# Altium schematic sheet PHOTODIODE.SchDoc
size 420 x 297 mm; SheetNumber: 3; SheetTotal: 7
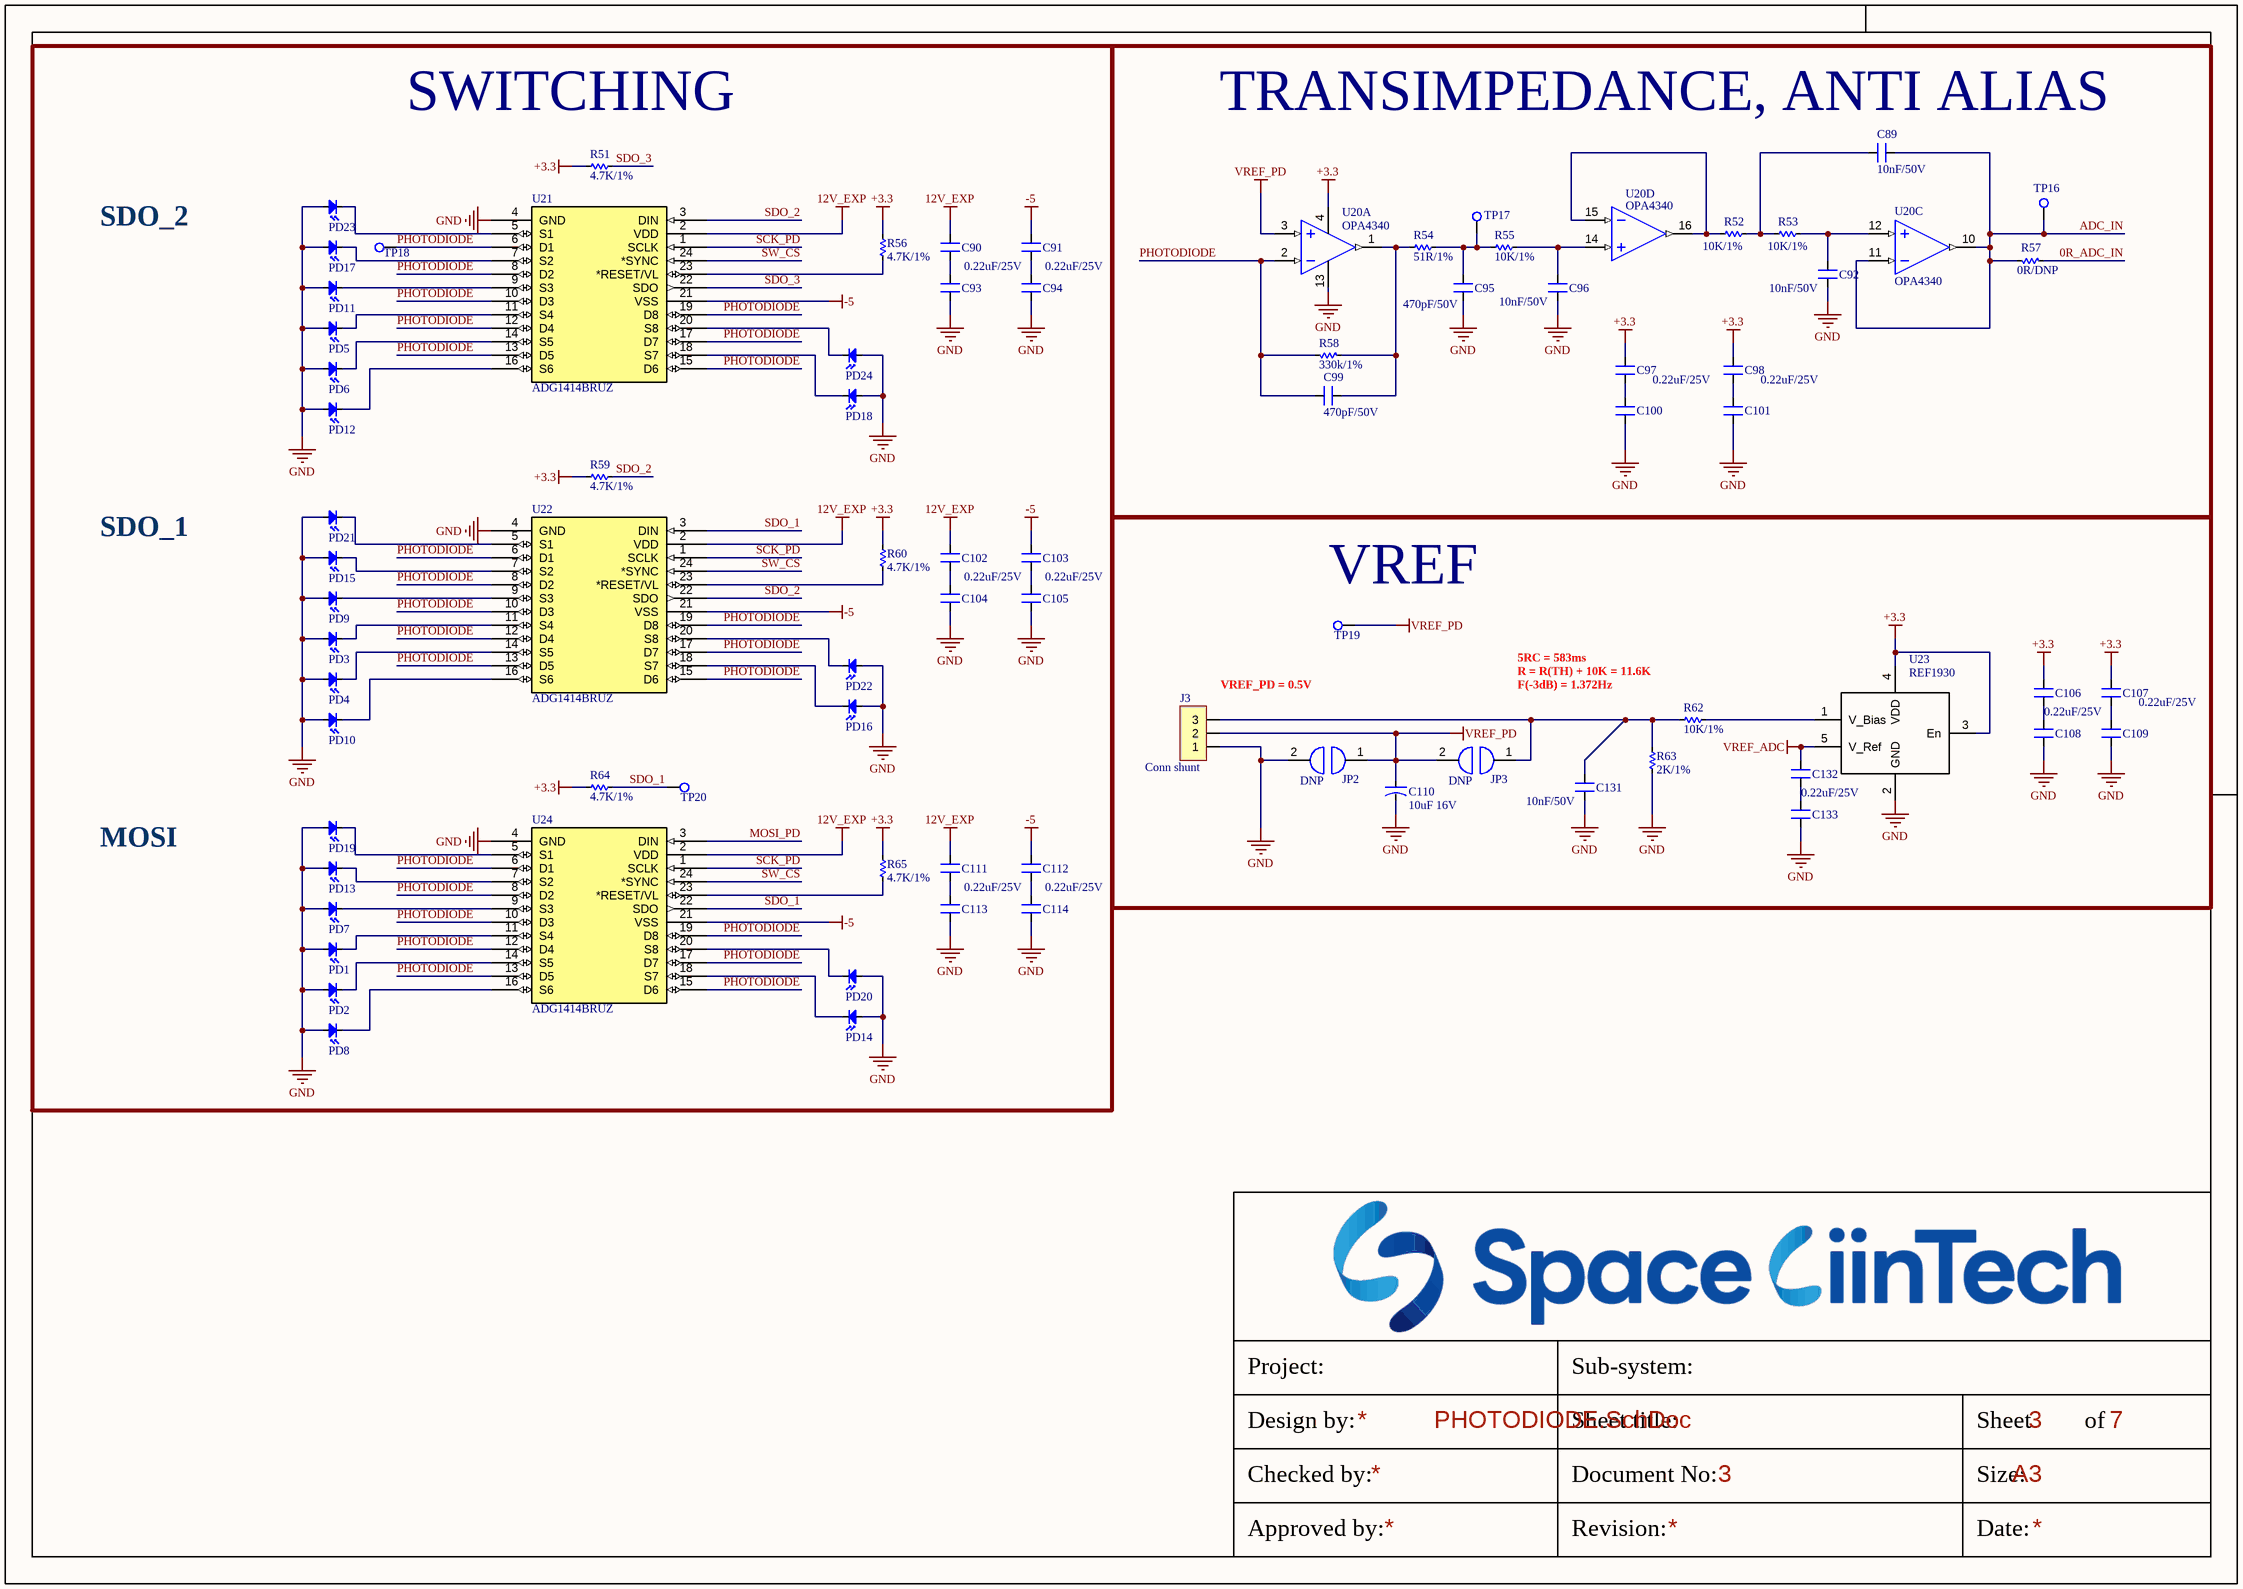
[diagram p0: PHOTODIODE.SchDoc]

## Parts
C89  10nF/50V  [CN-SMD-0603]
C90  0.22uF/25V  [CN-SMD-0603]
C91  0.22uF/25V  [CN-SMD-0603]
C92  10nF/50V  [CN-SMD-0603]
C93  0.22uF/25V  [CN-SMD-0603]  (value not drawn)
C94  0.22uF/25V  [CN-SMD-0603]  (value not drawn)
C95  470pF/50V  [CN-SMD-0603]
C96  10nF/50V  [CN-SMD-0603]
C97  0.22uF/25V  [CN-SMD-0603]
C98  0.22uF/25V  [CN-SMD-0603]
C99  470pF/50V  [CN-SMD-0603]
C100  0.22uF/25V  [CN-SMD-0603]  (value not drawn)
C101  0.22uF/25V  [CN-SMD-0603]  (value not drawn)
C102  0.22uF/25V  [CN-SMD-0603]
C103  0.22uF/25V  [CN-SMD-0603]
C104  0.22uF/25V  [CN-SMD-0603]  (value not drawn)
C105  0.22uF/25V  [CN-SMD-0603]  (value not drawn)
C106  0.22uF/25V  [CN-SMD-0603]
C107  0.22uF/25V  [CN-SMD-0603]
C108  0.22uF/25V  [CN-SMD-0603]  (value not drawn)
C109  0.22uF/25V  [CN-SMD-0603]  (value not drawn)
C110  10uF 16V  [CAP_TANT_1206]
C111  0.22uF/25V  [CN-SMD-0603]
C112  0.22uF/25V  [CN-SMD-0603]
C113  0.22uF/25V  [CN-SMD-0603]  (value not drawn)
C114  0.22uF/25V  [CN-SMD-0603]  (value not drawn)
C131  10nF/50V  [CN-SMD-0603]
C132  0.22uF/25V  [CN-SMD-0603]
C133  0.22uF/25V  [CN-SMD-0603]  (value not drawn)
J3  Conn shunt  [M50-3930342]
JP2  DNP  [JUMPER_1608]
JP3  DNP  [JUMPER_1608]
PD1  Photodiode  [VEMD5080X01]  (value not drawn)
PD2  Photodiode  [VEMD5080X01]  (value not drawn)
PD3  Photodiode  [VEMD5080X01]  (value not drawn)
PD4  Photodiode  [VEMD5080X01]  (value not drawn)
PD5  Photodiode  [VEMD5080X01]  (value not drawn)
PD6  Photodiode  [VEMD5080X01]  (value not drawn)
PD7  Photodiode  [VEMD5080X01]  (value not drawn)
PD8  Photodiode  [VEMD5080X01]  (value not drawn)
PD9  Photodiode  [VEMD5080X01]  (value not drawn)
PD10  Photodiode  [VEMD5080X01]  (value not drawn)
PD11  Photodiode  [VEMD5080X01]  (value not drawn)
PD12  Photodiode  [VEMD5080X01]  (value not drawn)
PD13  Photodiode  [VEMD5080X01]  (value not drawn)
PD14  Photodiode  [VEMD5080X01]  (value not drawn)
PD15  Photodiode  [VEMD5080X01]  (value not drawn)
PD16  Photodiode  [VEMD5080X01]  (value not drawn)
PD17  Photodiode  [VEMD5080X01]  (value not drawn)
PD18  Photodiode  [VEMD5080X01]  (value not drawn)
PD19  Photodiode  [VEMD5080X01]  (value not drawn)
PD20  Photodiode  [VEMD5080X01]  (value not drawn)
PD21  Photodiode  [VEMD5080X01]  (value not drawn)
PD22  Photodiode  [VEMD5080X01]  (value not drawn)
PD23  Photodiode  [VEMD5080X01]  (value not drawn)
PD24  Photodiode  [VEMD5080X01]  (value not drawn)
R51  4.7K/1%  [RES-SMD-0603]
R52  10K/1%  [RES-SMD-0603]
R53  10K/1%  [RES-SMD-0603]
R54  51R/1%  [RES-SMD-0603]
R55  10K/1%  [RES-SMD-0603]
R56  4.7K/1%  [RES-SMD-0603]
R57  0R/DNP  [RES-SMD-0603]
R58  330k/1%  [RES-SMD-0603]
R59  4.7K/1%  [RES-SMD-0603]
R60  4.7K/1%  [RES-SMD-0603]
R62  10K/1%  [RES-SMD-0603]
R63  2K/1%  [RES-SMD-0603]
R64  4.7K/1%  [RES-SMD-0603]
R65  4.7K/1%  [RES-SMD-0603]
TP16  Test_Point  [TESTPOINT]  (value not drawn)
TP17  Test_Point  [TESTPOINT]  (value not drawn)
TP18  Test_Point  [TESTPOINT]  (value not drawn)
TP19  Test_Point  [TESTPOINT]  (value not drawn)
TP20  Test_Point  [TESTPOINT]  (value not drawn)
U20  OPA4340  [SSOP16]  (parts A,C,D of 4)
U21  ADG1414BRUZ  [TSSOP24]
U22  ADG1414BRUZ  [TSSOP24]
U23  REF1930  [SOT23-5]
U24  ADG1414BRUZ  [TSSOP24]

## Blocks framed on the sheet
SWITCHING: C90 C91 C93 C94 C102-C105 C111-C114 PD1-PD24 R51 R56 R59 R60 R64 R65 TP18 TP20 U21 U22 U24
TRANSIMPEDANCE, ANTI ALIAS: C89 C92 C95-C101 R52-R55 R57 R58 TP16 TP17 U20
VREF: C106-C110 C131-C133 J3 JP2 JP3 R62 R63 TP19 U23

## Nets
12V_EXP: C90.2 C102.2 C111.2 U21.2(VDD) U22.2(VDD) U24.2(VDD)
+3.3: C97.2 C98.2 C106.2 C107.2 R51.2 R56.2 R59.2 R60.2 R64.2 R65.2 U20.4(+V) U23.3(En) U23.4(VDD)
-5: C91.2 C103.2 C112.2 U21.21(VSS) U22.21(VSS) U24.21(VSS)
GND: C92.1 C93.1 C94.1 C95.1 C96.1 C100.1 C101.1 C104.1 C105.1 C108.1 C109.1 C110.2 C113.1 C114.1 C131.1 C133.1 J3.1 JP2.2 PD1.1(A) PD2.1(A) PD3.1(A) PD4.1(A) PD5.1(A) PD6.1(A) PD7.1(A) PD8.1(A) PD9.1(A) PD10.1(A) PD11.1(A) PD12.1(A) PD13.1(A) PD14.1(A) PD15.1(A) PD16.1(A) PD17.1(A) PD18.1(A) PD19.1(A) PD20.1(A) PD21.1(A) PD22.1(A) PD23.1(A) PD24.1(A) R63.1 U20.13(-V) U21.4(GND) U22.4(GND) U23.2(GND) U24.4(GND)
VREF_ADC: C132.2 U23.5(V_Ref)
VREF_PD: C110.1 J3.2 JP2.1 JP3.2 TP19.1 U20.3(IN+)
0R_ADC_IN: R57.1
ADC_IN: C89.1 R57.2 TP16.1 U20.10(OUT) U20.11(IN-)
MOSI_PD: U24.3(DIN)
PHOTODIODE: C99.1 R58.1 TP18.1 U20.2(IN-) U21.6(D1) U21.8(D2) U21.10(D3) U21.12(D4) U21.13(D5) U21.15(D6) U21.17(D7) U21.19(D8) U22.6(D1) U22.8(D2) U22.10(D3) U22.12(D4) U22.13(D5) U22.15(D6) U22.17(D7) U22.19(D8) U24.6(D1) U24.8(D2) U24.10(D3) U24.12(D4) U24.13(D5) U24.15(D6) U24.17(D7) U24.19(D8)
SCK_PD: U21.1(SCLK) U22.1(SCLK) U24.1(SCLK)
SDO_1: R64.1 TP20.1 U22.3(DIN) U24.22(SDO)
SDO_2: R59.1 U21.3(DIN) U22.22(SDO)
SDO_3: R51.1 U21.22(SDO)
SW_CS: U21.24(*SYNC) U22.24(*SYNC) U24.24(*SYNC)
NetC89_2: C89.2 R52.2 R53.1
NetC90_1: C90.1 C93.2
NetC91_1: C91.1 C94.2
NetC92_2: C92.2 R53.2 U20.12(IN+)
NetC95_2: C95.2 R54.2 R55.1 TP17.1
NetC96_2: C96.2 R55.2 U20.14(IN+)
NetC97_1: C97.1 C100.2
NetC98_1: C98.1 C101.2
NetC99_2: C99.2 R54.1 R58.2 U20.1(OUT)
NetC102_1: C102.1 C104.2
NetC103_1: C103.1 C105.2
NetC106_1: C106.1 C108.2
NetC107_1: C107.1 C109.2
NetC111_1: C111.1 C113.2
NetC112_1: C112.1 C114.2
NetC131_2: C131.2 J3.3 JP3.1 R62.2 R63.2
NetC132_1: C132.1 C133.2
NetPD1_2: PD1.2(K) U24.11(S4)
NetPD2_2: PD2.2(K) U24.14(S5)
NetPD3_2: PD3.2(K) U22.11(S4)
NetPD4_2: PD4.2(K) U22.14(S5)
NetPD5_2: PD5.2(K) U21.11(S4)
NetPD6_2: PD6.2(K) U21.14(S5)
NetPD7_2: PD7.2(K) U24.9(S3)
NetPD8_2: PD8.2(K) U24.16(S6)
NetPD9_2: PD9.2(K) U22.9(S3)
NetPD10_2: PD10.2(K) U22.16(S6)
NetPD11_2: PD11.2(K) U21.9(S3)
NetPD12_2: PD12.2(K) U21.16(S6)
NetPD13_2: PD13.2(K) U24.7(S2)
NetPD14_2: PD14.2(K) U24.18(S7)
NetPD15_2: PD15.2(K) U22.7(S2)
NetPD16_2: PD16.2(K) U22.18(S7)
NetPD17_2: PD17.2(K) U21.7(S2)
NetPD18_2: PD18.2(K) U21.18(S7)
NetPD19_2: PD19.2(K) U24.5(S1)
NetPD20_2: PD20.2(K) U24.20(S8)
NetPD21_2: PD21.2(K) U22.5(S1)
NetPD22_2: PD22.2(K) U22.20(S8)
NetPD23_2: PD23.2(K) U21.5(S1)
NetPD24_2: PD24.2(K) U21.20(S8)
NetR52_1: R52.1 U20.15(IN-) U20.16(OUT)
NetR56_1: R56.1 U21.23(*RESET/VL)
NetR60_1: R60.1 U22.23(*RESET/VL)
NetR62_1: R62.1 U23.1(V_Bias)
NetR65_1: R65.1 U24.23(*RESET/VL)

## Notes on the sheet
- SDO_2
- SDO_1
- 5RC = 583ms
- (near J3) VREF_PD = 0.5V
- R = R(TH) + 10K = 11.6K
- F(-3dB) = 1.372Hz
- MOSI
- Project:
- Sub-system:
- Design by:
- Sheet title:
- Sheet
- of
- Checked by:
- Approved by:
- Revision:
- Document No:
- Size:
- Date:
- A3

## Library data of the parts
C89 C92 C96 C131 = CM: CL10B103KB8NNNC; Value: 103
C90 C91 C93 C94 C97 C98 C100-C109 C111-C114 C132 C133 = CM: CL10B224KA8NNNC; Value: 103
C95 C99 = CM: CL10B471KB8NNNC; Value: 103
C110 = CN-ALU-SMD: TAJA106K016RNJ; Published: 8-Jun-2000; LatestRevisionDate: 17-Jul-2002; LatestRevisionNote: Re-released for DXP Platform.; PackageReference: POLAR0.8; Publisher: Altium Limited
J3 = JP3: WR-PHD 2.54 mm Angled Socket Header; Manufacturer: W¨¹rth Elektronik eiSos GmbH; partNo: 613003143121; ComponentLink1 Description: Manufacturer; ComponentLink2 Description: Datasheet; NoPins: 03; Created Date: 29 March 2013; ComponentLink1URL: http://www.we-online.com; ComponentLink2URL: http://katalog.we-online.de/em/datasheet/6130xx143121.pdf; Created by: Karrer Zheng
JP2 JP3 = JUMPER
PD1-PD24 = Photodiode: VEMD5080X01
R51 R56 R59 R60 R64 R65 = Res-SMD: ERJ-3EKF4701V; Manufacturer: Generic Components; Class: Passive; Published: 08/06/2000; Publisher: Altium Hobart Technology Centre
R52 R53 R55 R62 = Res-SMD: ERJ-3EKF1002V; Manufacturer: Generic Components; Class: Passive; Published: 08/06/2000; Publisher: Altium Hobart Technology Centre
R54 = Res-SMD: ERJ-3EKF51R0V; Manufacturer: Generic Components; Class: Passive; Published: 08/06/2000; Publisher: Altium Hobart Technology Centre
R57 = Res-SMD: ERJ-3GEY0R00V; Manufacturer: Generic Components; Class: Passive; Published: 08/06/2000; Publisher: Altium Hobart Technology Centre
R58 = Res-SMD: ERJ-3EKF3303V; Manufacturer: Generic Components; Class: Passive; Published: 08/06/2000; Publisher: Altium Hobart Technology Centre
R63 = Res-SMD: ERJ-3EKF2001V; Manufacturer: Generic Components; Class: Passive; Published: 08/06/2000; Publisher: Altium Hobart Technology Centre
U20 = OPA4340: OPA4340UA/2K5; Supplier 1: Mouser; Supplier Part Number 1: 595-OPA4340UA/2K5
U23 = REF19xx: REF1941AIDDCT